# EAGLE design supply (EAGLE 7.6.0)
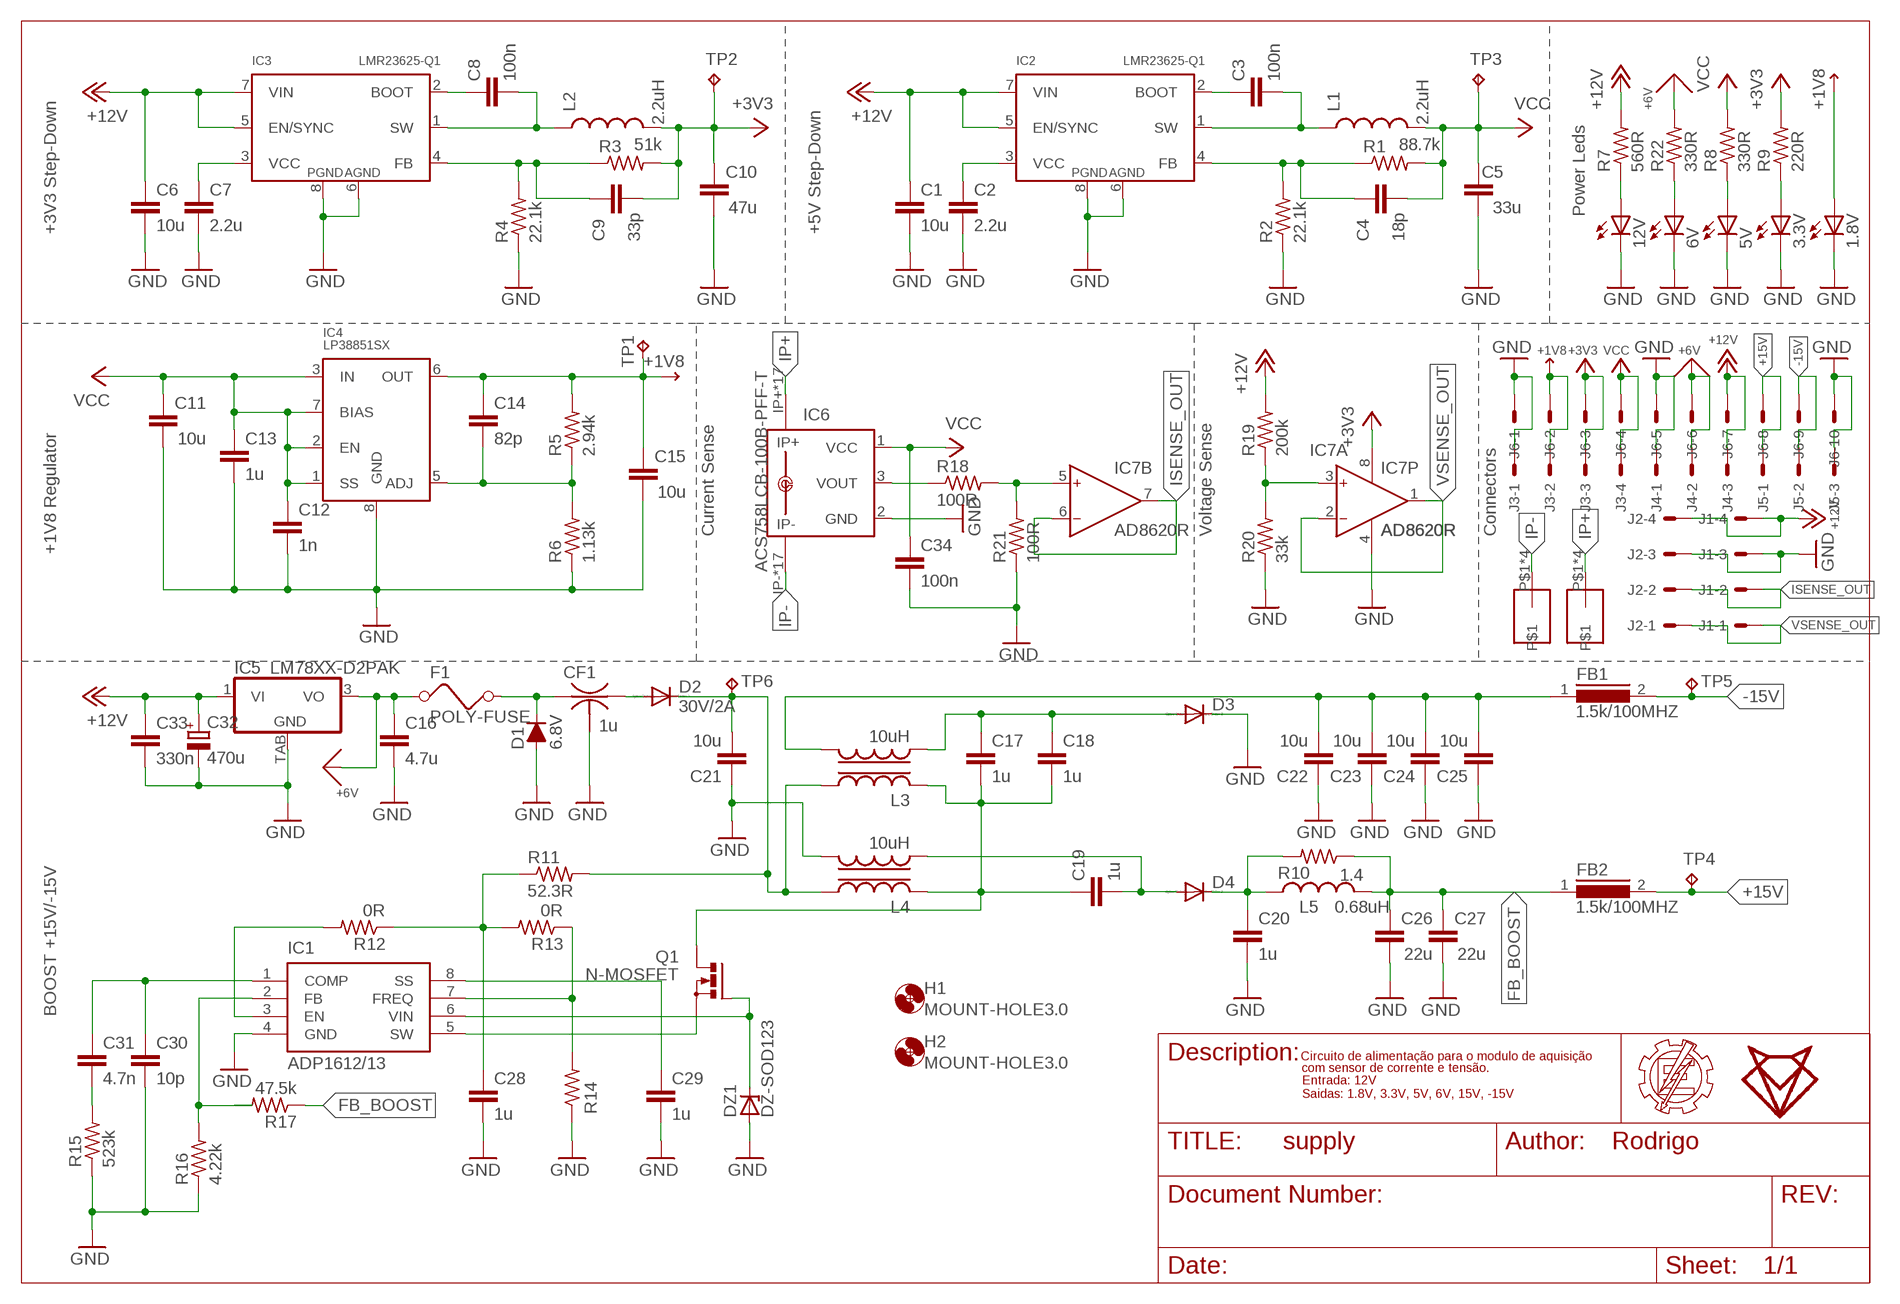
[diagram p0: schematic, sheet 1]

## Parts
1.8V  LEDCHIP-LED0805  [CHIP-LED0805]
3.3V  LEDCHIP-LED0805  [CHIP-LED0805]
5V  LEDCHIP-LED0805  [CHIP-LED0805]
6V  LEDCHIP-LED0805  [CHIP-LED0805]
12V  LEDCHIP-LED0805  [CHIP-LED0805]
C1  10u  C-EUC1206  [C1206]
C2  2.2u  C-EUC0805  [C0805]
C3  100n  C-EUC0805  [C0805]
C4  18p  C-EUC0805  [C0805]
C5  33u  C-EUC1206  [C1206]
C6  10u  C-EUC1206  [C1206]
C7  2.2u  C-EUC0805  [C0805]
C8  100n  C-EUC0805  [C0805]
C9  33p  C-EUC0805  [C0805]
C10  47u  C-EUC1206  [C1206]
C11  10u  C-EUC1206  [C1206]
C12  1n  C-EUC0805  [C0805]
C13  1u  C-EUC0805  [C0805]
C14  82p  C-EUC0805  [C0805]
C15  10u  C-EUC1206  [C1206]
C16  4.7u  C-EUC0805  [C0805]
C17  1u  C-EUC0805  [C0805]
C18  1u  C-EUC0805  [C0805]
C19  1u  C-EUC0603  [C0603]
C20  1u  C-EUC0603  [C0603]
C21  10u  C-EUC1206  [C1206]
C22  10u  C-EUC1206  [C1206]
C23  10u  C-EUC1206  [C1206]
C24  10u  C-EUC1206  [C1206]
C25  10u  C-EUC1206  [C1206]
C26  22u  C-EUC1206  [C1206]
C27  22u  C-EUC1206  [C1206]
C28  1u  C-EUC0603  [C0603]
C29  1u  C-EUC0603  [C0603]
C30  10p  C-EUC0603  [C0603]
C31  4.7n  C-EUC0603  [C0603]
C32  470u  CPOL-EU150CLZ-0810  [150CLZ-0810]
C33  330n  C-EUC0603  [C0603]
C34  100n  C-EUC0603  [C0603]
CF1  1u  NFM21C  [NFM21C]
D1  6.8V  D-FILL-SMB  [SMB]
D2  30V/2A  DIODE-SOD123  [SOD123]
D3  DIODE-SOD323-W  [SOD323-W]
D4  DIODE-SOD323-W  [SOD323-W]
DZ1  DZ-SOD123  [SOD123]
F1  POLY-FUSE  [1210]
FB1  1.5k/100MHZ  FERRITE_MMZ1608Y  [0603]
FB2  1.5k/100MHZ  FERRITE_MMZ1608Y  [0603]
H1  MOUNT-HOLE3.0  [3,0]
H2  MOUNT-HOLE3.0  [3,0]
IC1  ADP1612/13  [8-MSOP]
IC2  LMR23625-Q1  [SO08]
IC3  LMR23625-Q1  [SO08]
IC4  LP38851SX  [TO263-7]
IC5  LM78XX-D2PAK  [TO263-3]
IC6  ACS758LCB-100B-PFF-T  [CB-PFF]
IC7  AD8620R  [SO8]
J1  22-05-7048-04  [7395-04]
J2  22-27-2041-04  [6410-04]
J3  22-27-2041-04  [6410-04]
J4  22-27-2031-03  [6410-03]
J5  22-27-2031-03  [6410-03]
J6  22-05-7108-10  [7395-10]
L1  2.2uH  L-NR3010  [L-NR3010]
L2  2.2uH  L-NR3010  [L-NR3010]
L3  10uH  MSD7342  [MSD7342-SMD]
L4  10uH  MSD7342  [MSD7342-SMD]
L5  0.68uH  L-USL2012C  [L2012C]
Q1  N-MOSFET  [SOT23]
R1  88.7k  R-US_R0603  [R0603]
R2  22.1k  R-US_R0603  [R0603]
R3  51k  R-US_R0603  [R0603]
R4  22.1k  R-US_R0603  [R0603]
R5  2.94k  R-US_R0603  [R0603]
R6  1.13k  R-US_R0603  [R0603]
R7  560R  R-US_R0603  [R0603]
R8  330R  R-US_R0603  [R0603]
R9  220R  R-US_R0603  [R0603]
R10  1.4  R-US_R0603  [R0603]
R11  52.3R  R-US_R0603  [R0603]
R12  0R  R-US_R0603  [R0603]
R13  0R  R-US_R0603  [R0603]
R14  R-US_R0603  [R0603]
R15  523k  R-US_R0603  [R0603]
R16  4.22k  R-US_R0603  [R0603]
R17  47.5k  R-US_R0603  [R0603]
R18  100R  R-US_R0805  [R0805]
R19  200k  R-US_R0805  [R0805]
R20  33k  R-US_R0805  [R0805]
R21  100R  R-US_R0805  [R0805]
R22  330R  R-US_R0603  [R0603]
TP1  TPPAD1-13  [P1-13]
TP2  TPPAD1-13  [P1-13]
TP3  TPPAD1-13  [P1-13]
TP4  TPPAD1-13  [P1-13]
TP5  TPPAD1-13  [P1-13]
TP6  TPPAD1-13  [P1-13]
U$3  SCREWCONECTOR  [SCREWCONECTOR]
U$4  SCREWCONECTOR  [SCREWCONECTOR]

## Nets
+1V8: 1.8V.A C14.1 C15.2 IC4.6(OUT) J3.2 J6.2 R5.2 TP1.TP
+3V3: C9.2 C10.2 IC7.8(P:V+) J3.3 J6.3 L2.P$2 R3.2 R9.2 TP2.TP
+6V: C16.1 F1.1 IC5.3(VO) J4.2 J6.6 R22.2
+12V: C1.1 C6.1 C32.+ C33.1 IC2.5(EN/SYNC) IC2.7(VIN) IC3.5(EN/SYNC) IC3.7(VIN) IC5.1(VI) J1.4 J2.4 J4.3 J6.7 R7.2 R19.2
+15V: FB2.2 J5.1 J6.8 TP4.TP
-15V: FB1.2 J5.2 J6.9 TP5.TP
FB_BOOST: C26.2 C27.2 FB2.1 L5.2 R10.1 R17.1
GND: 1.8V.C 3.3V.C 5V.C 6V.C 12V.C C1.2 C2.2 C5.1 C6.2 C7.2 C10.1 C11.1 C12.2 C13.2 C15.1 C16.2 C20.2 C21.1 C22.1 C23.1 C24.1 C25.1 C26.1 C27.1 C28.2 C29.2 C30.2 C32.- C33.2 C34.2 CF1.2@1 D1.2(A) D3.C DZ1.A IC1.4(GND) IC2.6(AGND) IC2.8(PGND) IC3.6(AGND) IC3.8(PGND) IC4.8(GND) IC5.TAB(GND) IC6.2(GND) IC7.4(P:V-) J1.3 J2.3 J3.1 J4.1 J5.3 J6.1 J6.5 J6.10 L4.P$2 R2.1 R4.1 R6.1 R14.1 R15.1 R16.1 R20.1 R21.1
IP+: IC6.IP+ IC6.IP+@2(IP+) IC6.IP+@3(IP+) IC6.IP+@4(IP+) IC6.IP+@5(IP+) IC6.IP+@6(IP+) IC6.IP+@7(IP+) IC6.IP+@8(IP+) IC6.IP+@9(IP+) IC6.IP+@10(IP+) IC6.IP+@11(IP+) IC6.IP+@12(IP+) IC6.IP+@13(IP+) IC6.IP+@14(IP+) IC6.IP+@15(IP+) IC6.IP+@16(IP+) IC6.IP+@17(IP+) U$4.P$1 U$4.P$2 U$4.P$3 U$4.P$4
IP-: IC6.IP- IC6.IP-@2(IP-) IC6.IP-@3(IP-) IC6.IP-@4(IP-) IC6.IP-@5(IP-) IC6.IP-@6(IP-) IC6.IP-@7(IP-) IC6.IP-@8(IP-) IC6.IP-@9(IP-) IC6.IP-@10(IP-) IC6.IP-@11(IP-) IC6.IP-@12(IP-) IC6.IP-@13(IP-) IC6.IP-@14(IP-) IC6.IP-@15(IP-) IC6.IP-@16(IP-) IC6.IP-@17(IP-) U$3.P$1 U$3.P$2 U$3.P$3 U$3.P$4
ISENSE_OUT: IC7.6(B:IN-) IC7.7(B:OUT) J1.2 J2.2
N$1: C3.1 IC2.2(BOOT)
N$2: C7.1 IC3.3(VCC)
N$3: C2.1 IC2.3(VCC)
N$4: C3.2 IC2.1(SW) L1.P$1
N$5: C4.1 IC2.4(FB) R1.1 R2.2
N$6: C8.1 IC3.2(BOOT)
N$7: C8.2 IC3.1(SW) L2.P$1
N$8: C9.1 IC3.4(FB) R3.1 R4.2
N$9: CF1.1 D1.1(C) F1.2
N$10: CF1.3 D2.A
N$11: IC6.3(VOUT) R18.1
N$12: C14.2 IC4.5(ADJ) R5.1 R6.2
N$13: C31.2 R15.2
N$14: C17.1 C18.1 D3.A L3.P$4
N$15: C19.2 D4.A L4.P$4
N$16: 12V.A R7.1
N$17: C20.1 D4.C L5.1 R10.2
N$18: 3.3V.A R9.1
N$19: 5V.A R8.1
N$20: C22.2 C23.2 C24.2 C25.2 FB1.1 L3.P$2
N$21: IC1.5(SW) Q1.2(S)
N$22: C28.1 R11.1 R12.1 R13.2
N$23: IC1.3(EN) R12.2
N$24: IC1.2(FB) R16.2 R17.2
N$25: C29.1 IC1.8(SS)
N$26: IC1.7(FREQ) R13.1 R14.2
N$27: C30.1 C31.1 IC1.1(COMP)
N$28: 6V.A R22.1
N$29: DZ1.C IC1.6(VIN) Q1.1(G)
N$30: C21.2 D2.C L3.P$1 L4.P$1 R11.2 TP6.TP
N$31: C17.2 C18.2 C19.1 L3.P$3 L4.P$3 Q1.3(D)
N$32: IC7.3(A:IN+) R19.1 R20.2
N$33: IC7.5(B:IN+) R18.2 R21.2
VCC: C4.2 C5.2 C11.2 C12.1 C13.1 C34.1 IC4.1(SS) IC4.2(EN) IC4.3(IN) IC4.7(BIAS) IC6.1(VCC) J3.4 J6.4 L1.P$2 R1.2 R8.2 TP3.TP
VSENSE_OUT: IC7.1(A:OUT) IC7.2(A:IN-) J1.1 J2.1
Unconnected: CF1.2@2

## Notes on the sheet
- Power Leds
- +3V3 Step-Down | +5V Step-Down
- Current Sense | Voltage Sense | Connectors
- +1V8 Regulator
- BOOST +15V/-15V
- Description: | Circuito de alimentação para o modulo de aquisição
- com sensor de corrente e tensão.
- Entrada: 12V 
  Saidas: 1.8V, 3.3V, 5V, 6V, 15V, -15V
- Author: | Rodrigo

## Library data of the parts
1.8V 3.3V 5V 6V 12V = led:LED: LED OSRAM: - CHIPLED LG R971, LG N971, LY N971, LG Q971, LY Q971, LO R971, LY R971 LH N974, LH R974 LS Q976, LO Q976, LY Q976 LO Q996 - Hyper CHIPLED LW Q18S LB Q993, LB Q99A, LB R99A - SideLED LS A670, LO A670, LY A670, LG A670, LP A670 LB A673, LV A673, LT A673, LW A673 LH A674 LY A675 LS A676, LA A676, LO A676, LY A676, LW A676 LS A679, LY A679, LG A679 - Hyper Micro SIDELED® LS Y876, LA Y876, LO Y876, LY Y876 LT Y87S - SmartLED LW L88C, LW L88S LB L89C, LB L89S, LG L890 LS L89K, LO L89K, LY L89K LS L896, LA L896, LO L896, LY L896 - TOPLED LS T670, LO T670, LY T670, LG T670, LP T670 LSG T670, LSP T670, LSY T670, LOP T670, LYG T670 LG T671, LOG T671, LSG T671 LB T673, LV T673, LT T673, LW T673 LH T674 LS T676, LA T676, LO T676, LY T676, LB T676, LH T676, LSB T676, LW T676 LB T67C, LV T67C, LT T67C, LS T67K, LO T67K, LY T67K, LW E67C LS E67B, LA E67B, LO E67B, LY E67B, LB E67C, LV E67C, LT E67C LW T67C LS T679, LY T679, LG T679 LS T770, LO T770, LY T770, LG T770, LP T770 LB T773, LV T773, LT T773, LW T773 LH T774 LS E675, LA E675, LY E675, LS T675 LS T776, LA T776, LO T776, LY T776, LB T776 LHGB T686 LT T68C, LB T68C - Hyper Mini TOPLED® LB M676 - Mini TOPLED Santana® LG M470 LS M47K, LO M47K, LY M47K Source: http://www.osram.convergy.de LUXEON: - LUMILED® LXK2-PW12-R00, LXK2-PW12-S00, LXK2-PW14-U00, LXK2-PW14-V00 LXK2-PM12-R00, LXK2-PM12-S00, LXK2-PM14-U00 LXK2-PE12-Q00, LXK2-PE12-R00, LXK2-PE12-S00, LXK2-PE14-T00, LXK2-PE14-U00 LXK2-PB12-K00, LXK2-PB12-L00, LXK2-PB12-M00, LXK2-PB14-N00, LXK2-PB14-P00, LXK2-PB14-Q00 LXK2-PR12-L00, LXK2-PR12-M00, LXK2-PR14-Q00, LXK2-PR14-R00 LXK2-PD12-Q00, LXK2-PD12-R00, LXK2-PD12-S00 LXK2-PH12-R00, LXK2-PH12-S00 LXK2-PL12-P00, LXK2-PL12-Q00, LXK2-PL12-R00 Source: www.luxeon.com KINGBRIGHT: KA-3528ASYC Source: www.kingbright.com
C1-C31 C33 C34 = rcl:C-EU: CAPACITOR, European symbol
C32 = rcl:CPOL-EU: POLARIZED CAPACITOR, European symbol
CF1 = murata-filter:NFM: EMIFIL(R) (Capacitor type) Single Circuit Type for Signal Lines Source: http://search.murata.co.jp/Ceramy/image/img/PDF/ENG/L0111S0109NFM3DC.pdf; MPN: NFM21CC102R1H3D; OC_FARNELL: 1828795; OC_NEWARK: 84R0165
D1 = semicon-smd-ipc:D-FILL-: DIODE filled
D2-D4 = diode:DIODE-: DIODE
DZ1 = componentes telemetria:DZ-SOD123
F1 = componentes telemetria:POLY-FUSE; MF: Littelfuse; MPN: 1210L035YR
FB1 FB2 = componentes telemetria:FERRITE_MMZ1608Y; MF: TDK Corporation; MPN: MMZ1608Y152BTA00
H1 H2 = holes:MOUNT-HOLE: MOUNTING HOLE with drill center marker
IC1 = componentes telemetria:ADP1612/13; MF: Analog Devices; MPN: ADP1613ARMZ-R7
IC2 IC3 = componentes telemetria:LMR23625-Q1; MF: Texas Instruments; MPN: LMR23625-Q1
IC4 = componentes telemetria:LP38851SX; MF: Texas Instruments; MPN: LP38851SX-ADJ/NOPB
IC5 = componentes telemetria:LM78XX-D2PAK
IC6 = allegro:ACS758*: Thermally Enhanced, Fully Integrated, Hall Effect-Based Linear Current Sensor with 100 micro Ohm Current Conductor display layer 49 Reference in BRD and place VIAs on circles Source: http://www.allegromicro.com/en/Products/Part_Numbers/0758/0758.pdf; MPN: ACS758LCB-100B-PFF-T; OC_FARNELL: 1718998; OC_NEWARK: 04R7132
IC7 = analog-devices:AD8620: Precision, Very Low Noise, Low Input Bias Current, Wide Bandwidth JFET Operational Amplifiers Source: http://www.analog.com/static/imported-files/data_sheets/AD8610_8620.pdf; MF: ALTERA CORPORATION; MPN: AD8620ARZ; OC_FARNELL: 9994386; OC_NEWARK: 59K6972
J1-J3 = con-molex:22-?-04: CONNECTOR wire to board 2.54 mm (.1 inch) pitch header; OC_FARNELL: unknown; OC_NEWARK: unknown
J4 J5 = con-molex:22-?-03: CONNECTOR wire to board 2.54 mm (.1 inch) pitch header; OC_FARNELL: unknown; OC_NEWARK: unknown
J6 = con-molex:22-?-10: CONNECTOR wire to board 2.54 mm (.1 inch) pitch header; OC_FARNELL: unknown; OC_NEWARK: unknown
L1 L2 = MSP-EXP430F5659:L-NR3010
L3 L4 = componentes telemetria:MSD7342
L5 = rcl:L-US: INDUCTOR, American symbol
Q1 = componentes telemetria:N-MOSFET
R1-R22 = rcl:R-US_: RESISTOR, American symbol
TP1-TP6 = testpad:TP: Test pad
U$3 U$4 = Conectorparafuso:SCREWCONECTOR

## Net classes
0 default: width 0.203 mm, drill 0.406 mm, clearance 0.203 mm

## Board
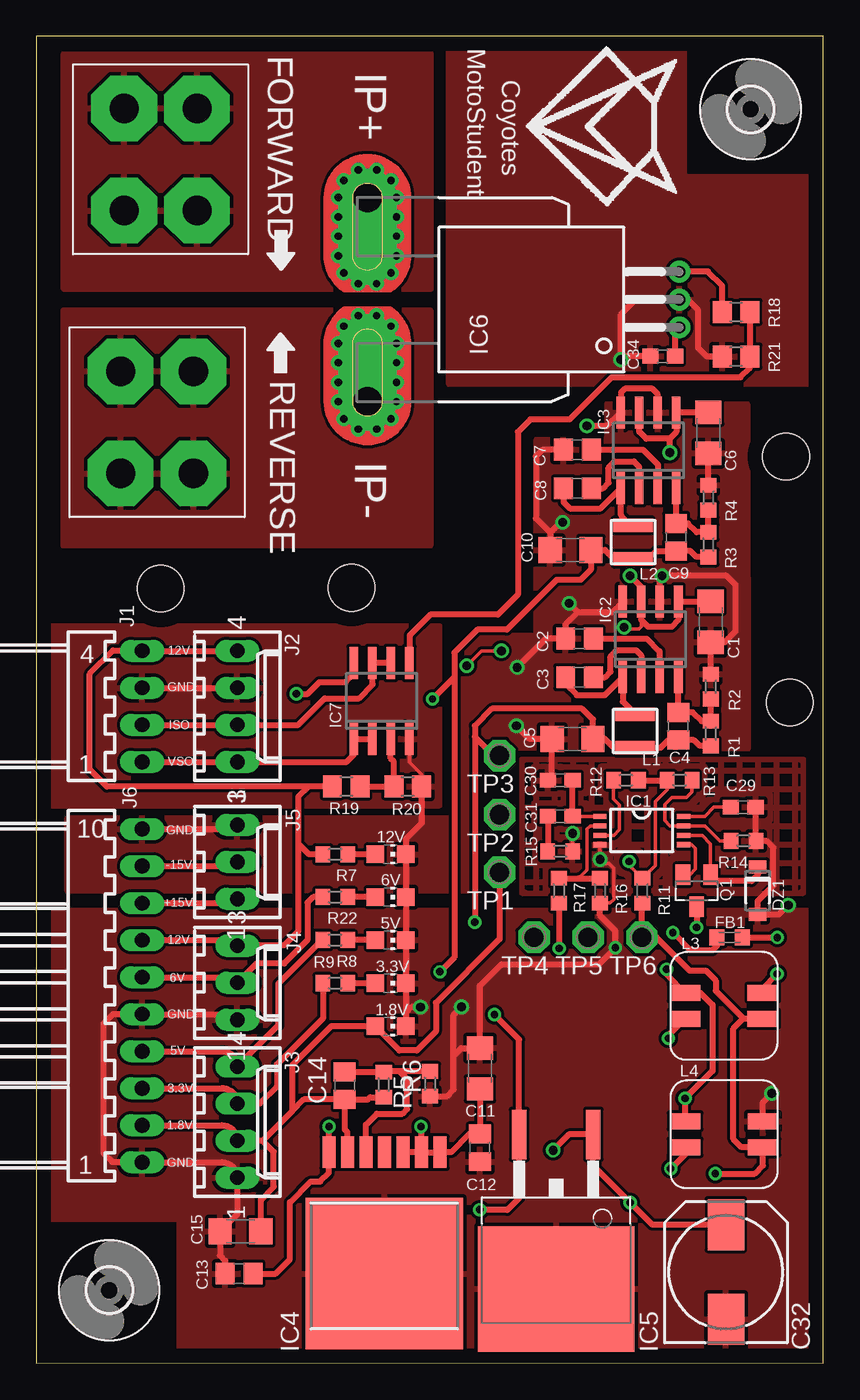
[diagram p1: board, top side]
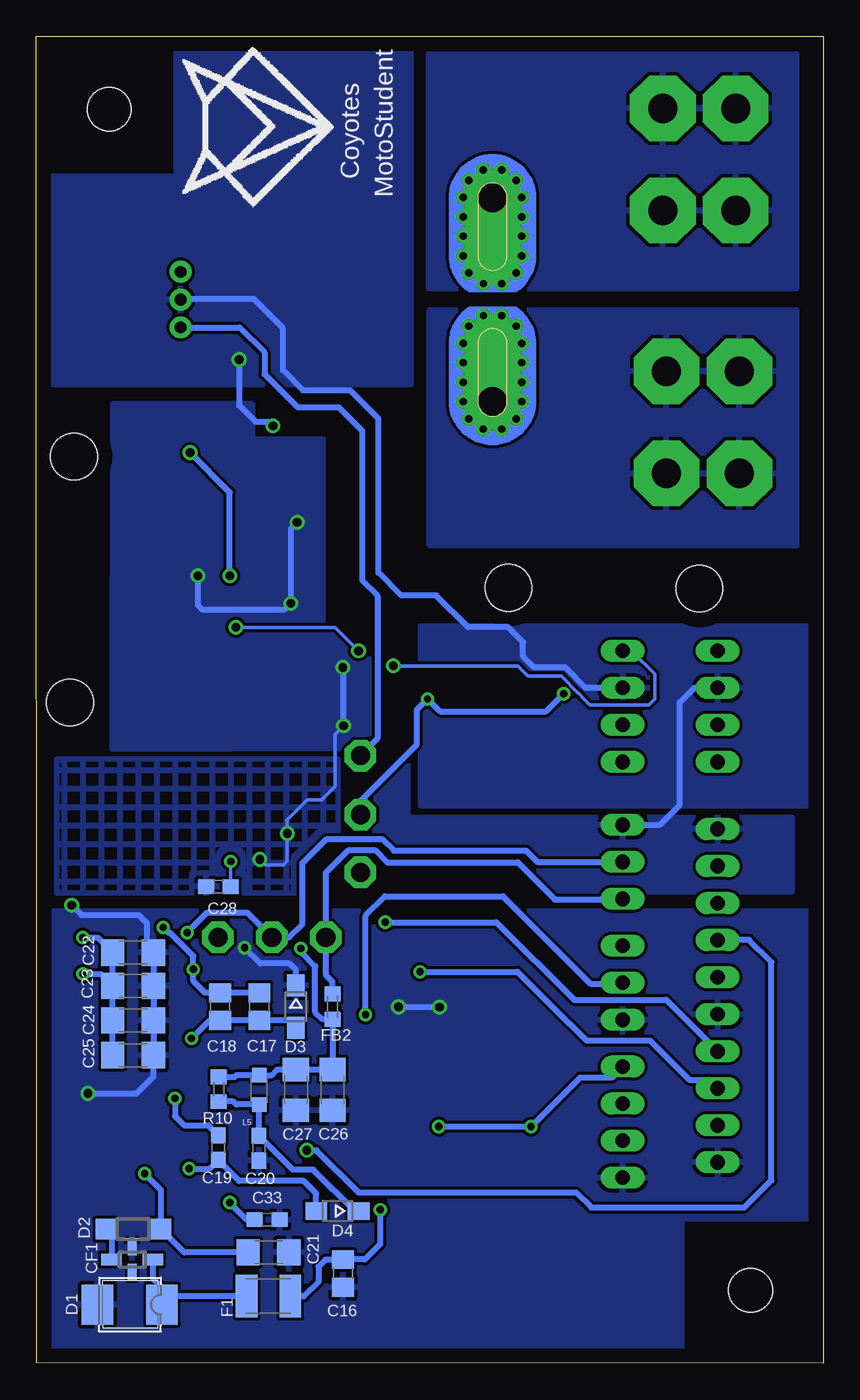
[diagram p2: board, bottom side, seen from below]

Size 54 x 91 mm. Coordinates in mm from the lower left corner, seen from the top.
Outline: 0,0 53.99,0.01 54,91 0,91 0,0
Copper layers (1*16): Top 0.035mm / dielectric 1.5mm / Bottom 0.035mm
Design rules "default": minimum track width 10mil, minimum drill 24mil, track to track 8mil, track to pad 8mil, pad to pad 8mil, via to via 8mil, smd to smd 8mil, copper to edge 40mil, drill to drill 8mil, minimum pad ring 10mil, minimum via ring 8mil, stop-mask expansion 4mil, vias tented up to drill 0mil, thermal gap 10mil
Holes 3.2 mm at 21.61,53.18 8.52,53.12 51.7,45.31 51.43,62.19

### Footprints (pad centres in the part's own frame; a part is rotated, then mirrored left to right if it is on the bottom)
CHIP-LED0805 = smd 1.2 x 1.2: A 0,-1.05; C 0,1.05
C1206 = smd 1.6 x 1.8: 1 -1.4,0; 2 1.4,0
C0805 = smd 1.3 x 1.5: 1 -0.95,0; 2 0.95,0
C0603 = smd 1.1 x 1: 1 -0.85,0; 2 0.85,0
150CLZ-0810 = smd 3.5 x 2.5: + 3.25,0; - -3.25,0
NFM21C = smd 1.4 x 0.8: 1 -1.425,0; 3 1.425,0 | smd 0.6 x 1.1: 2@1 0,-0.85; 2@2 0,0.85
SMB = smd 2.159 x 2.743: 1 -2.311,-0.127; 2 2.108,-0.102
SOD123 = smd 1.4 x 1.4: A 1.9,0; C -1.9,0
SOD323-W = smd 1.5 x 1.2: A 1.45,0; C -1.45,0
SOD123' = smd 0.91 x 1.22: A 1.625,0; C -1.625,0
1210 = smd 1.5 x 2.9: 1 -1.5,0; 2 1.5,0
0603 = smd 1.05 x 1.08: 1 -0.875,0; 2 0.875,0
3,0 = hole 3: 0,0
8-MSOP = smd 0.9 x 0.35: 1 -2.875,0.975; 2 -2.875,0.325; 3 -2.875,-0.325; 4 -2.875,-0.975; 5 2.875,-0.975; 6 2.875,-0.325; 7 2.875,0.325; 8 2.875,0.975
SO08 = smd 0.6 x 2.2: 1 -1.905,-2.6; 2 -0.635,-2.6; 3 0.635,-2.6; 4 1.905,-2.6; 5 1.905,2.6; 6 0.635,2.6; 7 -0.635,2.6; 8 -1.905,2.6
TO263-7 = smd 0.91 x 2.16: 1 -3.81,-8.32; 2 -2.54,-8.32; 3 -1.27,-8.32; 4 0,-8.32; 5 1.27,-8.32; 6 2.54,-8.32; 7 3.81,-8.32 | smd 10.8 x 10.41: 8 0,0
TO263-3 = smd 1 x 3.4: 1 -2.54,-9.14; 3 2.54,-9.14 | smd 10.7 x 8.6: TAB 0,1.46
CB-PFF = drill 0.8 pad 1.5: 1 -1.91,-21.4; 2 0,-21.4; 3 1.91,-21.4 | drill 2 pad 4 offset: IP+ 7,0; IP- -7,0 | drill 0.5 pad 0.9: IP+@2 8.89,0.635; IP+@3 8.89,-0.635; IP+@4 8.175,-1.625; IP+@5 7,-2; IP+@6 5.675,-2; IP+@7 4.35,-2; IP+@8 3,-2; IP+@9 1.825,-1.625; IP+@10 1.1,-0.625; IP+@11 1.1,0.625; IP+@12 1.825,1.625; IP+@13 3,2; IP+@14 4.35,2; IP+@15 5.675,2; IP+@16 7,2; IP+@17 8.175,1.625; IP-@2 -8.89,0.635; IP-@3 -8.89,-0.635; IP-@4 -8.175,-1.625; IP-@5 -7,-2; IP-@6 -5.675,-2; IP-@7 -4.325,-2; IP-@8 -3,-2; IP-@9 -1.825,-1.625; IP-@10 -1.1,-0.625; IP-@11 -1.1,0.625; IP-@12 -1.825,1.625; IP-@13 -3,2; IP-@14 -4.325,2; IP-@15 -5.675,2; IP-@16 -7,2; IP-@17 -8.175,1.625
SO8 = smd 0.6 x 2.2: 1 -1.905,-2.6; 2 -0.635,-2.6; 3 0.635,-2.6; 4 1.905,-2.6; 5 1.905,2.6; 6 0.635,2.6; 7 -0.635,2.6; 8 -1.905,2.6
7395-04 = drill 1.016 long: 1 3.81,0; 2 1.27,0; 3 -1.27,0; 4 -3.81,0
6410-04 = drill 1.016 long: 1 3.81,0; 2 1.27,0; 3 -1.27,0; 4 -3.81,0
6410-03 = drill 1.016 long: 1 2.54,0; 2 0,0; 3 -2.54,0
7395-10 = drill 1.016 long: 1 11.43,0; 2 8.89,0; 3 6.35,0; 4 3.81,0; 5 1.27,0; 6 -1.27,0; 7 -3.81,0; 8 -6.35,0; 9 -8.89,0; 10 -11.43,0
L-NR3010 = smd 0.9 x 2.7: P$1 -1.15,0; P$2 1.15,0
MSD7342-SMD = smd 1.092 x 2.108: P$1 0.889,2.667; P$2 -0.889,2.667; P$3 -0.889,-2.667; P$4 0.889,-2.667
L2012C = smd 1 x 1: 1 -1,0; 2 1,0
SOT23 = smd 1 x 1.4: 1 -0.95,-1.1; 2 0.95,-1.1; 3 0,1.1
R0603 = smd 1 x 1.1: 1 -0.85,0; 2 0.85,0
R0805 = smd 1.3 x 1.5: 1 -0.95,0; 2 0.95,0
P1-13 = drill 1.321 pad 2.159 octagon: TP 0,0
SCREWCONECTOR = drill 2 pad 4.5 octagon: P$1 2.5,3.5; P$2 2.5,-3.5; P$3 -2.5,-3.5; P$4 -2.5,3.5

### Placement (x,y rotation side)
1.8V  24.3,23.1 270 top
3.3V  24.3,26.06 270 top
5V  24.3,29.02 270 top
6V  24.3,31.97 270 top
12V  24.3,34.9 270 top
C1  46.26,50.85 270 top
C2  37.26,49.69 180 top
C3  37.26,47.04 180 top
C4  44.03,43.69 270 top
C5  36.78,42.81 0 top
C6  46.1,63.81 270 top
C7  37.12,62.65 180 top
C8  37.12,60 180 top
C9  43.89,56.65 270 top
C10  36.64,55.77 0 top
C11  30.43,20.21 270 top
C12  30.42,14.77 270 top
C13  13.91,6.14 180 top
C14  21.15,19.03 90 top
C15  14,9.03 0 top
C16  32.96,6.15 270 bottom
C17  38.71,24.45 90 bottom
C18  41.4,24.45 90 bottom
C19  41.53,14.78 270 bottom
C20  38.73,14.74 270 bottom
C21  38.08,7.59 180 bottom
C22  47.37,28.16 180 bottom
C23  47.37,25.88 180 bottom
C24  47.37,23.5 180 bottom
C25  47.37,21.12 180 bottom
C26  33.69,18.74 90 bottom
C27  36.2,18.74 90 bottom
C28  41.52,32.69 180 bottom
C29  48.49,38.13 0 top
C30  35.94,39.98 180 top
C31  35.94,37.51 180 top
C32  47.31,6.24 90 top
C33  38.18,9.84 0 bottom
C34  42.97,69.07 180 top
CF1  47.44,7.1 180 bottom
D1  47.7,3.88 180 bottom
D2  47.35,9.18 180 bottom
D3  36.2,24.45 270 bottom
D4  33.35,10.43 180 bottom
DZ1  DZ-SOD123  [SOD123']  49.48,32.4 270 top
F1  38.08,4.59 180 bottom
FB1  47.56,29.2 180 top
FB2  33.69,24.45 90 bottom
H1  49,86 0 top
H2  5,5 0 top
IC1  41.53,36.53 0 top
IC2  42.13,49.65 0 top
IC3  41.99,62.61 0 top
IC4  23.88,6.14 180 top
IC5  35.66,6.54 180 top
IC6  22.71,72.95 90 top
IC7  23.68,45.42 0 top
J1  7.26,45.05 270 top
J2  13.78,45.05 270 top
J3  13.78,16.53 270 top
J4  13.78,26.09 270 top
J5  13.78,34.38 270 top
J6  7.26,25.2 270 top
L1  41.08,43.36 270 top
L2  40.94,56.32 270 top
L3  47.17,24.51 270 top
L4  47.18,15.7 270 top
L5  38.72,18.74 90 bottom
Q1  45.3,32.4 180 top
R1  46.26,43.18 270 top
R2  46.26,46.4 270 top
R3  46.1,56.14 270 top
R4  46.1,59.36 270 top
R5  23.83,19.1 270 top
R6  27.01,19.16 90 top
R7  20.5,34.9 180 top
R8  20.5,29.02 180 top
R9  20.5,26.06 180 top
R10  41.49,18.78 270 bottom
R11  41.57,32.4 270 top
R12  40.45,39.98 180 top
R13  44.13,39.98 180 top
R14  48.51,35.83 180 top
R15  35.94,35.1 180 top
R16  38.67,32.4 90 top
R17  35.86,32.4 90 top
R18  48,72.1 0 top
R19  21.25,39.55 180 top
R20  25.48,39.55 180 top
R21  48,69.05 0 top
R22  20.5,31.97 180 top
TP1  31.77,33.66 180 top
TP2  31.77,37.62 180 top
TP3  31.77,41.67 180 top
TP4  34.14,29.2 180 top
TP5  37.84,29.2 180 top
TP6  41.54,29.2 180 top
U$3  8.27,64.53 0 top
U$4  8.52,82.56 0 top
U$11  [LOGO_COYOTES]  32.94,91.06 270 top
U$12  [LOGO_COYOTES]  32.95,78.58 90 bottom
U$13  [SETA_DIREITA]  15.38,77.72 270 top
U$14  [SETA_DIREITA]  18.15,67.9 90 top

### Tracks (layer width: path | path; a pad name or v marks a point on that pad's centre or on a via)
+1V8
  Top 0.406: J6.2 12.73,16.31 arc-90 J3.2 15.52,15.26 | 17.54,17.28 17.54,20.41 20.23,23.1 1.8V.A 24.91,21.44 26.1,21.44 27.4,22.74 27.4,24.72 31.77,29.09 TP1.TP | 17.54,17.28 15.52,15.26 | C15.2 15.4,11.21 16.28,12.09 16.28,14.5 15.52,15.26 | C14.1 18.34,18.08 17.54,17.28 | C14.1 21.15,16.03 21.32,15.86 21.32,14.48 IC4.6 | C14.1 22.73,18.08 22.89,18.24 R5.2
+3V3  (via drill 0.5)
  Top 0.406: J6.3 12.73,18.85 arc-90 J3.3 15.32,17.8 16.51,18.99 16.51,20.49 19.65,23.63 R9.2 | R3.2 45.28,55.29 44.86,55.71 C9.2 42.52,55.69 42,55.17 L2.P$2 40.91,55.2 39.58,55.2 39.01,55.77 C10.2 38.04,54.43 37.33,53.72 35.68,53.72 32.27,50.31 30.25,50.31 28.67,48.73 28.67,47.05 | 28.67,47.05 28.67,27.83 v27.68,26.84 | 28.67,47.05 v27.17,45.55 | v17.83,45.91 18.61,45.91 19.41,46.71 21.22,46.71 21.78,47.27 IC7.8
  Bottom 0.406: v27.68,26.84 21,26.84 17.43,23.27 17.41,23.27 16.26,22.12 11.9,22.12 9.21,19.43 7.84,19.43 J6.3 | v17.83,45.91 19.04,44.7 26.31,44.7 v27.16,45.55 v27.17,45.55 27.9,44.82 27.9,42.44 31.77,38.57 TP2.TP
+6V  (via drill 0.5)
  Top 0.406: J6.6 13.4,26.47 arc-90 J4.2 15.1,27.41 17,27.41 18.6,29.01 18.6,31.59 18.98,31.97 R22.2 | v30.41,10.52 30.43,10.5 32.31,10.5 33.12,11.31 IC5.3 33.12,22.2 v31.42,23.9
  Bottom 0.406: F1.1 36.56,4.57 35.66,4.57 34.66,5.57 34.66,6.61 34.17,7.1 C16.1 31.46,7.11 30.41,8.16 v30.41,10.52 | v31.42,23.9 31.42,30.69 30.09,32.02 21.99,32.02 15.99,26.02 13.85,26.02 J4.2
+12V  (via drill 0.5, 0.6)
  Top 0.254: 41.49,50.98 41.49,50.51 41.32,50.34 40.45,50.34 v40.32,50.47 | v31.9,48.85 30.54,48.85 v29.52,47.83
  Top 0.406: J2.4 J1.4 7.24,48.88 5.25,48.88 3.66,47.29 3.66,40.71 4.82,39.55 18.66,39.55 | J6.7 13.4,29.01 arc-90 J4.3 13.8,28.65 17,28.65 17.96,29.61 17.96,35.64 | C32.+ 42.25,9.49 v40.73,11.01 38.19,13.55 IC5.1 36.53,15.68 v35.45,14.6 | R19.2 18.66,39.55 | 18.66,39.55 17.96,38.85 17.96,35.64 | 43.45,63.4 43.9,63.84 IC3.5 C6.1 | 43.45,63.4 41.84,63.4 41.36,63.88 IC3.7 | R7.2 18.7,34.9 17.96,35.64 | C1.1 IC2.5 44.03,50.95 43.58,50.5 41.97,50.5 41.49,50.98 IC2.7 41.49,53.24 v40.73,54.01 | v43.46,62.45 43.46,63.39 43.45,63.4
  Bottom 0.254: v40.32,50.47 33.52,50.47 v31.9,48.85 | v29.52,47.83 20.98,47.83 20.27,47.12 17.99,47.12 16.84,45.97 16.83,45.97 16.39,45.53 16.39,45.52 16.01,45.14 11.99,45.14 11.57,45.56 11.57,47.26 13.17,48.86 J2.4
  Bottom 0.406: v40.73,11.01 40.73,10.99 39.57,9.83 C33.1 | v40.73,54.01 40.73,59.72 v43.46,62.45 | v35.45,14.6 34.81,14.6 31.91,11.7 16.97,11.7 15.94,10.67 5.44,10.67 3.58,12.53 3.58,27.51 5.11,29.04 7.23,29.04 J6.7
+15V
  Top 0.406: J6.8 13.49,31.55 arc90 J5.1
  Bottom 0.406: FB2.2 33.69,26.15 34.12,26.58 34.12,29.18 TP4.TP 34.14,33.64 32.63,35.15 30.73,35.15 29.93,34.35 20.98,34.35 18.43,31.8 13.82,31.8 J5.1
-15V  (via drill 0.5)
  Top 0.406: J6.9 13.49,34.09 arc90 J5.2 | FB1.2 46.69,28.61 46.39,28.32 44.87,28.32 v43.66,29.53
  Bottom 0.406: v43.66,29.53 42.29,30.9 39.54,30.9 TP5.TP 36.65,29.2 35.75,30.1 35.75,34.29 34.09,35.95 30.28,35.95 29.48,35.15 20.4,35.15 19.61,34.36 13.8,34.36 J5.2
FB_BOOST  (via drill 0.5)
  Top 0.406: R17.1 v35.86,28.45
  Bottom 0.406: R10.1 41.46,19.6 40.42,19.6 40.28,19.74 L5.2 37.88,19.74 37.48,20.14 C27.2 C26.2 FB2.1 34.38,23.57 34.87,24.06 34.87,27.21 35.86,28.2 v35.86,28.45
GND  (via drill 0.5, 0.6)
  Top 0.254: R15.1 v36.79,36.33 | IC1.4 v38.67,34.54 38.94,34.27 39.29,34.27 39.62,33.94 39.62,31.82 39.35,31.55 R16.1 | R20.1 26.43,40.37 25.59,41.21 IC7.4
  Top 0.406: J1.3 J2.3 | J6.10 13.49,36.63 arc90 J5.3 | J4.1 arc90 13.4,23.93 J6.5 5.24,23.93 4.59,23.28 4.59,14.4 5.19,13.8 7.23,13.8 J6.1 12.73,13.77 arc-90 J3.1 13.78,10.21 C15.1 12.6,7.38 12.95,7.03 C13.2 | R16.1 38.66,30.72 39.72,29.66 v39.72,28.49 38.59,27.36 31.91,27.36 30.43,25.88 C11.1 29.14,21.6 28.62,21.08 | 25.35,24.02 3.3V.C 5V.C 6V.C 12V.C 25.37,34.92 25.37,35.96 26.43,37.02 R20.1 | 25.35,24.02 1.8V.C | C29.2 49.36,38.11 R14.1 49.39,35.8 50.11,35.8 50.56,35.35 50.56,32.78 49.48,31.7 DZ1.A 50.95,30.77 v51.58,31.41 | R4.1 C6.2 | C30.2 35.36,40.24 35.36,42.79 C5.1 33.83,42.81 v32.93,43.71 | L4.P$2 49.85,17.89 v50.46,18.5 | R2.1 C1.2 47.22,49.45 47.98,50.21 47.98,53.38 47.34,54.02 v42.94,54.02 v42.93,54.01 42.77,53.84 IC2.6 | C7.2 34.72,62.65 34.27,62.2 34.27,57.95 35.25,56.97 | 35.25,56.97 C10.1 | IC2.8 40.23,52.22 39.51,51.5 37.12,51.5 | 37.12,51.5 36.31,50.69 C2.2 34.95,49.69 v32.98,47.72 | 37.12,51.5 37.12,51.55 v36.55,52.12 | v36.11,57.67 35.95,57.67 35.25,56.97 | R6.1 28.16,18.31 28.62,18.77 28.62,21.08 | 28.62,21.08 28.62,23.89 v29.16,24.43 | v26.35,24.42 25.75,24.42 25.35,24.02 | C34.2 40.34,69.07 v40.1,68.83 40.1,71.94 41.14,72.98 44.08,72.98 IC6.2 44.13,72.97 44.66,72.97 45.41,72.22 45.41,69.62 45.98,69.05 R21.1 | v37.77,64.29 39.16,64.29 IC3.8 40.1,65.22 40.1,66.57 40.36,66.83 42.26,66.83 42.62,66.47 IC3.6
  Bottom 0.254: v38.67,34.54 38.29,34.16 37.06,34.16 36.79,34.43 v36.79,36.33 36.79,37.27 35.43,38.63 34.45,38.63 33.52,39.56 33.52,43.12 v32.93,43.71
  Bottom 0.406: D3.C 36.2,26.96 36.64,27.4 38.63,27.4 v39.72,28.49 | C22.1 45.97,27.66 | 45.97,27.66 C23.1 C24.1 C25.1 45.97,19.66 47.13,18.5 v50.46,18.5 | v51.58,31.41 v51.57,31.41 50.9,30.74 46.98,30.74 46.43,30.19 46.43,28.12 45.97,27.66 | J2.3 16.32,46.32 17.72,47.72 19.86,47.72 20.62,48.48 20.62,49.46 21.64,50.48 24.39,50.48 26.57,52.66 28.97,52.66 30.53,54.22 30.53,64.8 32.45,66.72 35.71,66.72 37.09,68.1 37.09,70.99 39.08,72.98 44.08,72.98 IC6.2 | v32.93,43.72 v32.93,43.71 32.98,43.76 v32.98,47.72 | v36.11,57.67 36.54,57.24 v36.54,52.13 v36.55,52.12 36.98,51.69 42.63,51.69 42.93,51.99 v42.93,54.01 | v29.16,24.43 v26.36,24.43 v26.35,24.42 | v40.1,68.83 40.1,65.71 38.97,64.58 38.06,64.58 v37.77,64.29 | J5.3 11.24,36.92 9.86,38.3 9.86,45.32 8.86,46.32 J1.3
  pour Top: 0.14,9.89 9.78,9.89 9.78,0.25 53.7,0.25 53.7,31.01 0.14,31.01
  pour Bottom: 2.13,37.38 28.5,37.38 28.5,49.91 34.32,49.91 34.32,63.35 39.17,63.35 39.17,65.78 48.77,65.78 48.79,42.11 32.33,42.18 32.33,32.36 2.13,32.36
  pour Top: 2.12,37.39 28.49,37.39 28.49,49.92 34.31,49.92 34.31,63.36 39.16,63.36 39.16,65.79 48.77,65.79 48.8,42.12 32.32,42.19 32.32,32.37 2.12,32.37
  pour Top (hatched): 52.63,41.38 33.31,41.38 33.31,32.25 52.62,32.25 52.63,32.25
  pour Bottom: 0.11,9.88 9.75,9.88 9.75,0.24 53.67,0.24 53.67,31 0.11,31
  pour Bottom (hatched): 33.29,41.4 52.61,41.4 52.61,32.27 33.3,32.27 33.29,32.27
  pour Top: 27.66,50.53 0.7,50.53 0.7,38.26 27.66,38.26
  pour Bottom: 0.7,50.53 27.66,50.53 27.66,38.26 0.7,38.26
  pour Bottom: 52.09,67.14 28.31,67.14 28.31,90.68 44.42,90.68 44.42,81.38 53.52,81.38 53.66,81.38 53.66,67.4 53.66,67.17 53.66,67.14 52.1,67.14
  pour Top: 52.1,67.14 28.32,67.14 28.32,90.68 44.43,90.68 44.43,81.38 53.53,81.38 53.67,81.38 53.67,67.4 53.67,67.17 53.67,67.14 52.11,67.14
IP+
  pour Bottom: 1.88,73.69 27.05,73.69 27.05,89.84 1.88,89.84
  pour Top: 27.05,73.68 1.88,73.68 1.88,89.83 27.05,89.83
IP-
  pour Bottom: 1.85,56.08 27.02,56.08 27.02,72.23 1.85,72.23
  pour Top: 27.03,56.07 1.86,56.07 1.86,72.22 27.03,72.22
ISENSE_OUT
  Top 0.406: J1.2 J2.2 17.96,43.78 19.78,45.6 22.12,45.6 23.07,46.55 23.07,47.99 IC7.7 IC7.6
N$1
  Top 0.406: C3.1 39,47.04 39.39,47.43 39.39,48.47 39.82,48.9 41.13,48.9 41.49,48.54 IC2.2
N$2
  Top 0.406: C7.1 41.61,62.65 42.64,61.62 42.64,60.02 IC3.3
N$3
  Top 0.406: C2.1 41.87,49.69 42.75,48.81 42.75,47.06 IC2.3
N$4
  Top 0.406: C3.2 36.31,46.58 37.07,45.82 38.99,45.82 IC2.1 40.23,45.37 L1.P$1
N$5
  Top 0.406: IC2.4 C4.1 45.03,44.64 45.64,44.03 R1.1 R2.2
N$6
  Top 0.406: C8.1 38.86,60 39.25,60.39 39.25,61.42 39.67,61.84 41,61.84 41.35,61.49 IC3.2
N$7
  Top 0.406: C8.2 36.17,59.06 36.61,58.62 38.7,58.62 IC3.1 40.1,59.99 40.1,58.18 40.15,58.13 40.15,58.11 40.79,57.47 L2.P$1
N$8
  Top 0.406: IC3.4 C9.1 44.7,57.59 45.3,56.99 R3.1 R4.2
N$9
  Bottom 0.406: F1.2 44.81,4.59 | 44.81,4.59 D1.1 | CF1.1 46.02,5.8 44.81,4.59
N$10
  Bottom 0.406: D2.A 49.25,9.14 48.84,8.73 48.84,7.12 CF1.3
N$11
  Top 0.406: R18.1 47.05,73.89 46.07,74.87 IC6.3
N$12
  Top 0.406: R6.2 24.9,20.01 | 24.9,20.01 23.89,20.01 R5.1 23.8,19.98 C14.2 | IC4.5 22.61,16.35 23.36,17.1 25.1,17.1 25.43,17.43 25.43,19.48 24.9,20.01
N$13
  Top 0.406: C31.2 R15.2
N$14  (via drill 0.5)
  Top 0.406: v43.36,22.27 43.36,22.48 L3.P$4
  Bottom 0.406: D3.A 36.2,23.23 36.47,23.5 C17.1 C18.1 42.13,23.5 v43.36,22.27
N$15  (via drill 0.5)
  Top 0.406: L4.P$4 44.51,14.33 v43.52,13.34
  Bottom 0.406: v43.52,13.34 42.12,13.34 C19.2 40.1,12.5 35.67,12.5 34.8,11.63 D4.A
N$16
  Top 0.406: 12V.A R7.1
N$17
  Bottom 0.406: R10.2 40.49,17.94 40.29,17.74 L5.1 C20.1 36.4,13.26 35.01,13.26 32.18,10.43 D4.C
N$18
  Top 0.406: 3.3V.A R9.1
N$19
  Top 0.406: 5V.A R8.1
N$20  (via drill 0.5)
  Top 0.406: L3.P$2 49.84,25.72 v50.81,26.69 | FB1.1 v50.82,29.2 v50.83,29.19
  Bottom 0.406: C25.2 C24.2 C23.2 | C23.2 C22.2 49.8,29.19 v50.83,29.19 | v50.81,26.69 49.58,26.69 C23.2
N$21
  Top 0.254: Q1.2 44.84,33.5 45.22,33.88 45.22,35.29 44.94,35.57 44.42,35.57 IC1.5
N$22  (via drill 0.5)
  Top 0.254: R13.2 43.28,39.34 42.45,38.51 42.45,34.13 R11.1 40.67,34.15 v40.67,34.41
  Top 0.406: R12.1 R13.2
  Bottom 0.254: C28.1 v40.67,34.41
N$23
  Top 0.254: R12.2 39.6,38.68 40.01,38.27 40.01,36.59 39.61,36.19 IC1.3
N$24
  Top 0.254: IC1.2 37.99,36.85 37.77,36.63 37.77,33.83 37.19,33.25
  Top 0.406: R17.2 37.19,33.25 R16.2
N$25
  Top 0.254: IC1.8 45.87,37.51 46.49,38.13 C29.1
N$26
  Top 0.254: R14.2 46.88,35.82 45.84,36.85 IC1.7 43.47,36.86 43.12,37.21 43.12,38.32 43.59,38.79 44.59,38.79 44.98,39.18 R13.1
N$27
  Top 0.254: C31.1 IC1.1
  Top 0.406: C31.1 C30.1
N$28
  Top 0.406: 6V.A R22.1
N$29
  Top 0.254: Q1.1 46.25,35.62 45.68,36.19 IC1.6
  Top 0.406: DZ1.C 49.48,33.47 49.07,33.06 46.69,33.06 Q1.1
N$30  (via drill 0.5)
  Top 0.406: v46.58,12.99 49.28,12.99 49.85,13.56 L4.P$1 48.37,14.81 47.82,15.36 47.82,22.95 48.51,23.64 | 48.51,23.64 49.82,23.64 L3.P$1 | 48.51,23.64 46.61,25.54 46.61,26.24 45.92,26.93 44.81,26.93 42.54,29.2 TP6.TP 41.54,31.52 R11.2
  Bottom 0.406: C21.2 43.86,7.59 D2.C 45.45,11.86 v46.58,12.99
N$31  (via drill 0.5)
  Top 0.406: L4.P$3 44.51,18.15 v44.5,18.16 46.38,20.04 46.38,24.57 45.55,25.4 L3.P$3 43.24,26.66 v43.24,27.01 | Q1.3 v45.3,29.89
  Bottom 0.406: v44.5,18.16 44.5,16.94 43.87,16.31 42.21,16.31 C19.1 | C17.2 C18.2 42.41,25.4 43.24,26.23 v43.24,27.01 43.24,27.92 44.38,29.06 44.39,29.06 44.86,29.53 44.94,29.53 v45.3,29.89
N$32
  Top 0.406: R19.1 R20.2 24.53,41.26 24.31,41.48 IC7.3
N$33
  Top 0.406: IC7.5 25.6,48.03 25.6,49.91 27.03,51.34 31.65,51.34 33.02,52.71 33.02,63.87 33.88,64.73 36.58,64.73 39.47,67.62 48.31,67.62 48.93,68.24 48.93,69.03 R21.2 R18.2
VCC  (via drill 0.5)
  Top 0.406: J6.4 12.73,21.39 arc-90 J3.4 16.59,23.15 16.59,26.02 19.59,29.02 R8.2 | R1.2 45.53,42.33 45.12,42.74 C4.2 43.36,42.74 42.83,42.21 L1.P$2 39.59,42.21 38.99,42.81 C5.2 38.18,44.15 37.43,44.9 31.27,44.9 30.08,43.71 30.08,42.95 | IC4.2 IC4.3 | IC4.2 IC4.1 28.46,14.47 29.72,15.73 C12.1 | v20.07,16.22 IC4.7 20.07,13.06 19.47,12.46 18.82,12.46 17.4,11.04 17.4,7.12 16.42,6.14 C13.1 | v26.39,16.22 26.39,14.49 IC4.2 | C11.2 C12.1 | C12.1 | 30.08,42.95 v30.08,30.25 v30.07,30.24 | TP3.TP 31.36,41.67 30.08,42.95 | C34.1 43.82,70.75 IC6.1
  Bottom 0.406: v26.39,16.22 v20.07,16.22 16.71,19.58 14.52,19.58 13.78,20.32 J3.4 | v30.07,30.24 22.44,30.24 17.14,24.94 17.11,24.92 10.79,24.92 J6.4 | IC6.1 40.06,71.04 38.35,69.33 38.35,67.83 36.08,65.56 33.26,65.56 31.65,63.95 31.65,53.68 30.61,52.64 30.61,42.83 TP3.TP
VSENSE_OUT
  Top 0.406: J1.1 J2.1 21.28,41.24 21.78,41.74 IC7.1 IC7.2

### Text on the board
tPlace: MotoStudent | Coyotes
bPlace: MotoStudent | Coyotes
tNames: FORWARD | IP+ | REVERSE | IP- | 12V | GND | ISO | VSO | GND | -15V | +15V | 12V | 6V | GND | 5V | 3.3V | 1.8V | GND